# Altium project Battery_Charger_BQ24650.PrjPcb (part 1 of 3)
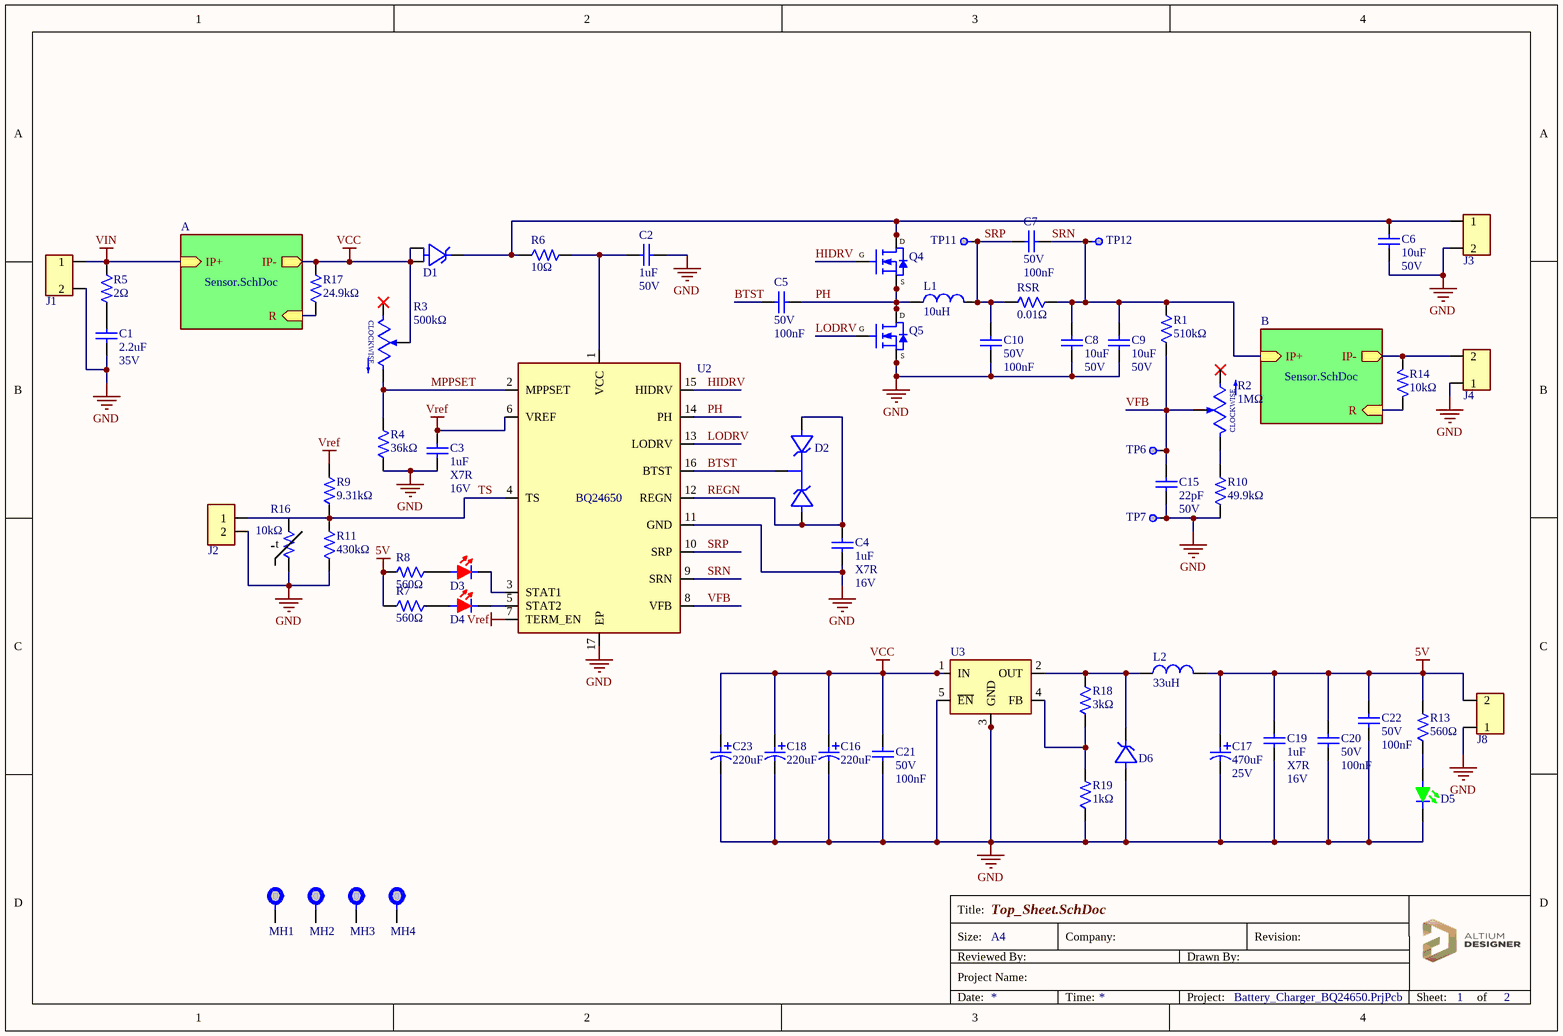
[diagram p0: Top_Sheet.SchDoc]
rev: 1.0.2
2 sheets, 83 parts. Net scope: hierarchical (ports join the sheet entries above them; power ports are global).
Board file: Battery_Charger_BQ24650.PcbDoc
Sheets:
  Top_Sheet.SchDoc
    A = Sensor.SchDoc
    B = Sensor.SchDoc

## Sheet Top_Sheet.SchDoc
size A4; Revision: 1.0.2; SheetNumber: 1; SheetTotal: 2; SheetSize: A4

### Parts
?  (no value)  (graphical)
C1  value 2.2uF  Voltage Rating: 35V  [CAP-1206-IPC]  (hidden comment: GMK316B7225KLHT)
C2  value 1uF  Voltage Rating: 50V  [CAP-0805-H1.35-IPC]  (hidden comment: CL21B105KBFNNNE)
C3  value 1uF  Temperature Characteristics Code: X7R  Rated DC Voltage (URdc): 16V  [CAP-0603-IPC]  (hidden comment: CL10B105KO8NNNC)
C4  value 1uF  Temperature Characteristics Code: X7R  Rated DC Voltage (URdc): 16V  [CAP-0603-IPC]  (hidden comment: CL10B105KO8NNNC)
C5  Voltage Rating: 50V  Capacitance: 100nF  [CAP-0603-IPC]  (hidden comment: CL10B104KB8NNWC)
C6  value 10uF  Voltage Rating: 50V  [CAP-1210-IPC]  (hidden comment: CL32B106KBJNNNE)
C7  Voltage Rating: 50V  Capacitance: 100nF  [CAP-0603-IPC]  (hidden comment: CL10B104KB8NNWC)
C8  value 10uF  Voltage Rating: 50V  [CAP-1210-IPC]  (hidden comment: CL32B106KBJNNNE)
C9  value 10uF  Voltage Rating: 50V  [CAP-1210-IPC]  (hidden comment: CL32B106KBJNNNE)
C10  Voltage Rating: 50V  Capacitance: 100nF  [CAP-0603-IPC]  (hidden comment: CL10B104KB8NNWC)
C15  value 22pF  Voltage: 50V  [CAP-0603-IPC]  (hidden comment: 06035C220JAT2A)
C16  value 220uF  [CAP RADIAL CAN TH D10mm, H12.5mm, LS5mm]  (hidden comment: UVZ1H221MPD)
C17  value 470uF  Voltage Rating: 25V  [CAP RADIAL CAN TH D8mm,H13mm,LS3.5mm_860020474014]  (hidden comment: 860020474014)
C18  value 220uF  [CAP RADIAL CAN TH D10mm, H12.5mm, LS5mm]  (hidden comment: UVZ1H221MPD)
C19  value 1uF  Temperature Characteristics Code: X7R  Rated DC Voltage (URdc): 16V  [CAP-0603-IPC]  (hidden comment: CL10B105KO8NNNC)
C20  Voltage Rating: 50V  Capacitance: 100nF  [CAP-0603-IPC]  (hidden comment: CL10B104KB8NNWC)
C21  Voltage Rating: 50V  Capacitance: 100nF  [CAP-0603-IPC]  (hidden comment: CL10B104KB8NNWC)
C22  Voltage Rating: 50V  Capacitance: 100nF  [CAP-0603-IPC]  (hidden comment: CL10B104KB8NNWC)
C23  value 220uF  [CAP RADIAL CAN TH D10mm, H12.5mm, LS5mm]  (hidden comment: UVZ1H221MPD)
D1  SDT10A45P5-13D  [Diode_PowerDI5]  (value not drawn)
D2  BAT54C,215  [SOT-23-3, TO-236-3, SC-59-IPC]  (value not drawn)
D3  LTST-C190KRKT  [LED-0603(1608)]  (value not drawn)
D4  LTST-C190KRKT  [LED-0603(1608)]  (value not drawn)
D5  LTST-C190GKT  [LED-0603(1608)]  (value not drawn)
D6  PMEG3050EP,115  [SOD-128/CFP5-IPC]  (value not drawn)
J1  282836-2  [HDR/Conn 2 Pos 5mm_282836-2]  (value not drawn)
J2  B2B-XH-A  [HDR 2 POS 2.5mm ST M TH_B2B-XH-A]  (value not drawn)
J3  282836-2  [HDR/Conn 2 Pos 5mm_282836-2]  (value not drawn)
J4  282836-2  [HDR/Conn 2 Pos 5mm_282836-2]  (value not drawn)
J8  282836-2  [HDR/Conn 2 Pos 5mm_282836-2]  (value not drawn)
L1  value 10uH  [Ind 13.45mm x 12.6mm_125CDMCCDS-100MC]  (hidden comment: 125CDMCCDS-100MC)
L2  value 33uH  [IND 12.8mmx12.8mm_B82477G4333M000]  (hidden comment: B82477G4333M000)
MH1  Mounting Hole  [Mounting Hole D3.5mm]  (value not drawn)  (no BOM)
MH2  Mounting Hole  [Mounting Hole D3.5mm]  (value not drawn)  (no BOM)
MH3  Mounting Hole  [Mounting Hole D3.5mm]  (value not drawn)  (no BOM)
MH4  Mounting Hole  [Mounting Hole D3.5mm]  (value not drawn)  (no BOM)
Q4  SIS412DN-T1-GE3  [Trans POWERPAK1212-8_SIS412DN-T1-GE3]  (value not drawn)
Q5  SIS412DN-T1-GE3  [Trans POWERPAK1212-8_SIS412DN-T1-GE3]  (value not drawn)
R1  value 510kΩ  [RES-0603-IPC]  (hidden comment: RMCF0603FT510K)
R2  value 1MΩ  [POT SMD_3361P-1-504GLF]  (hidden comment: 3361P-1-105GLF)
R3  value 500kΩ  [POT SMD_3361P-1-504GLF]  (hidden comment: 3361P-1-504GLF)
R4  value 36kΩ  [RES-0603-IPC]  (hidden comment: RK73H1JTTD3602F)
R5  Vaue: 2Ω  [RES-2512-IPC]  (hidden comment: RMCF2512JT2R00)
R6  value 10Ω  [RES-1206-IPC]  (hidden comment: CSRT1206FT10R0)
R7  value 560Ω  [RES-0603-IPC]  (hidden comment: RK73H1JTTD5600F)
R8  value 560Ω  [RES-0603-IPC]  (hidden comment: RK73H1JTTD5600F)
R9  value 9.31kΩ  [RES-0603-IPC]  (hidden comment: RMCF0603FT9K31)
R10  value 49.9kΩ  [RES-0603-IPC]  (hidden comment: RMCF0603FT49K9)
R11  value 430kΩ  [RES-0603-IPC]  (hidden comment: RMCF0603FT430K)
R13  value 560Ω  [RES-0603-IPC]  (hidden comment: RK73H1JTTD5600F)
R14  value 10kΩ  [RES-0603-IPC]  (hidden comment: RK73H1JTTD1002F)
R16  value 10kΩ  (hidden comment: NTCLE413E2103F520L)  (mechanical)
R17  value 24.9kΩ  [RES-0805-IPC]  (hidden comment: RK73H2ATTD2492F)
R18  value 3kΩ  [RES-0603-IPC]  (hidden comment: RT0603DRE073KL)
R19  value 1kΩ  [RES-0603-IPC]  (hidden comment: RN73R1JTTD1001B25)
RSR  value 0.01Ω  [RES-2512-IPC]  (hidden comment: CRA2512-FZ-R010ELF)
TP6  TP  [TP SMD 1mm Dia]  (value not drawn)  (no BOM)
TP7  TP  [TP SMD 1mm Dia]  (value not drawn)  (no BOM)
TP11  TP  [TP SMD 1mm Dia]  (value not drawn)  (no BOM)
TP12  TP  [TP SMD 1mm Dia]  (value not drawn)  (no BOM)
U2  BQ24650RVAR  [VQFN-16_EP_w_via]  (value not drawn)
U3  LM2596DSADJG  [TO-263-5/DDPAK/D²Pak_LM2679SX-5.0/NOPB]  (value not drawn)

### Sub-sheets
A = Sensor.SchDoc: IP+ (in), IP- (out), R (in)
B = Sensor.SchDoc: IP+ (in), IP- (out), R (in)

### Nets
5V: C17.1 C19.2 C20.2 C22.2 J8.2 L2.1 R7.1 R8.1 R13.1
GND: C1.2 C2.2 C3.1 C4.1 C6.1 C8.1 C9.1 C10.1 C15.2 C16.2 C17.2 C18.2 C19.1 C20.1 C21.1 C22.1 C23.2 D5.2(K) D6.1(A) J1.2 J2.2 J3.2 J4.1 J8.1 Q5.1(S) Q5.2(S) Q5.3(S) R4.1 R10.2 R11.2 R19.2 TP7.1 U2.11(GND) U2.17(EP) U3.3(GND) U3.5(~{EN}) U3.6(GND)
VCC: C16.1 C18.1 C21.2 C23.1 D1.1(A) D1.2(A) R3.2(WIPER) R17.1 U3.1(IN) ; sheet A/IP-
VIN: J1.1 R5.2 ; sheet A/IP+
Vref: C3.2 R9.1 U2.6(VREF) U2.7(TERM_EN)
BTST: C5.1 D2.3(K) U2.16(BTST)
HIDRV: Q4.4(G) U2.15(HIDRV)
LODRV: Q5.4(G) U2.13(LODRV)
MPPSET: R3.3(CW) R4.2 U2.2(MPPSET)
PH: C5.2 L1.1 Q4.1(S) Q4.2(S) Q4.3(S) Q5.5(D) Q5.6(D) Q5.7(D) Q5.8(D) Q5.9(D) U2.14(PH)
REGN: C4.2 D2.1(A1) D2.2(A2) U2.12(REGN)
SRN: C7.1 C8.2 C9.2 R1.1 RSR.2 TP12.1 U2.9(SRN) ; sheet B/IP+
SRP: C7.2 C10.2 L1.2 RSR.1 TP11.1 U2.10(SRP)
TS: J2.1 R9.2 R11.1 U2.4(TS)
VFB: C15.1 R1.2 R2.2(WIPER) TP6.1 U2.8(VFB)
NetC1_1: C1.1 R5.1
NetC2_1: C2.1 R6.1 U2.1(VCC)
NetC6_2: C6.2 D1.3(K) J3.1 Q4.5(D) Q4.6(D) Q4.7(D) Q4.8(D) Q4.9(D) R6.2
NetC14A_2: R17.2 ; sheet A/R
NetC14B_2: R14.2 ; sheet B/R
NetD3_1: D3.1(A) R8.2
NetD3_2: D3.2(K) U2.3(STAT1)
NetD4_1: D4.1(A) R7.2
NetD4_2: D4.2(K) U2.5(STAT2)
NetD5_1: D5.1(A) R13.2
NetD6_2: D6.2(K) L2.2 R18.2 U3.2(OUT)
NetJ4_2: J4.2 R14.1 ; sheet B/IP-
NetR2_1: R2.1(CCW) R10.1
NetR18_1: R18.1 R19.1 U3.4(FB)

Not connected (* = marked no-connect by the designer): MH1 1; MH2 1; MH3 1; MH4 1; R2 3(CW)*; R3 1(CCW)*

### Notes on the sheet
- Title:
- Size:
- Reviewed By:
- Project Name:
- Company:
- Drawn By:
- Revision:
- Date:
- Time:
- Project:
- Sheet:
- of
- (in symbol IC Misc. Batt Charge_BQ24650RVAR) BQ24650
- (in symbol Res 10k 1% NTC Bead 3435k TH_NTCLE413E2103F520L) t
- (in symbol Res POT 1MΩ 10% 0.5W_3361P-1-105GLF) CLOCKWISE
- (in symbol Res POT 500kΩ 10% 0.5W_3361P-1-504GLF) CLOCKWISE